# EAGLE design snowflake (EAGLE 9.6.2)
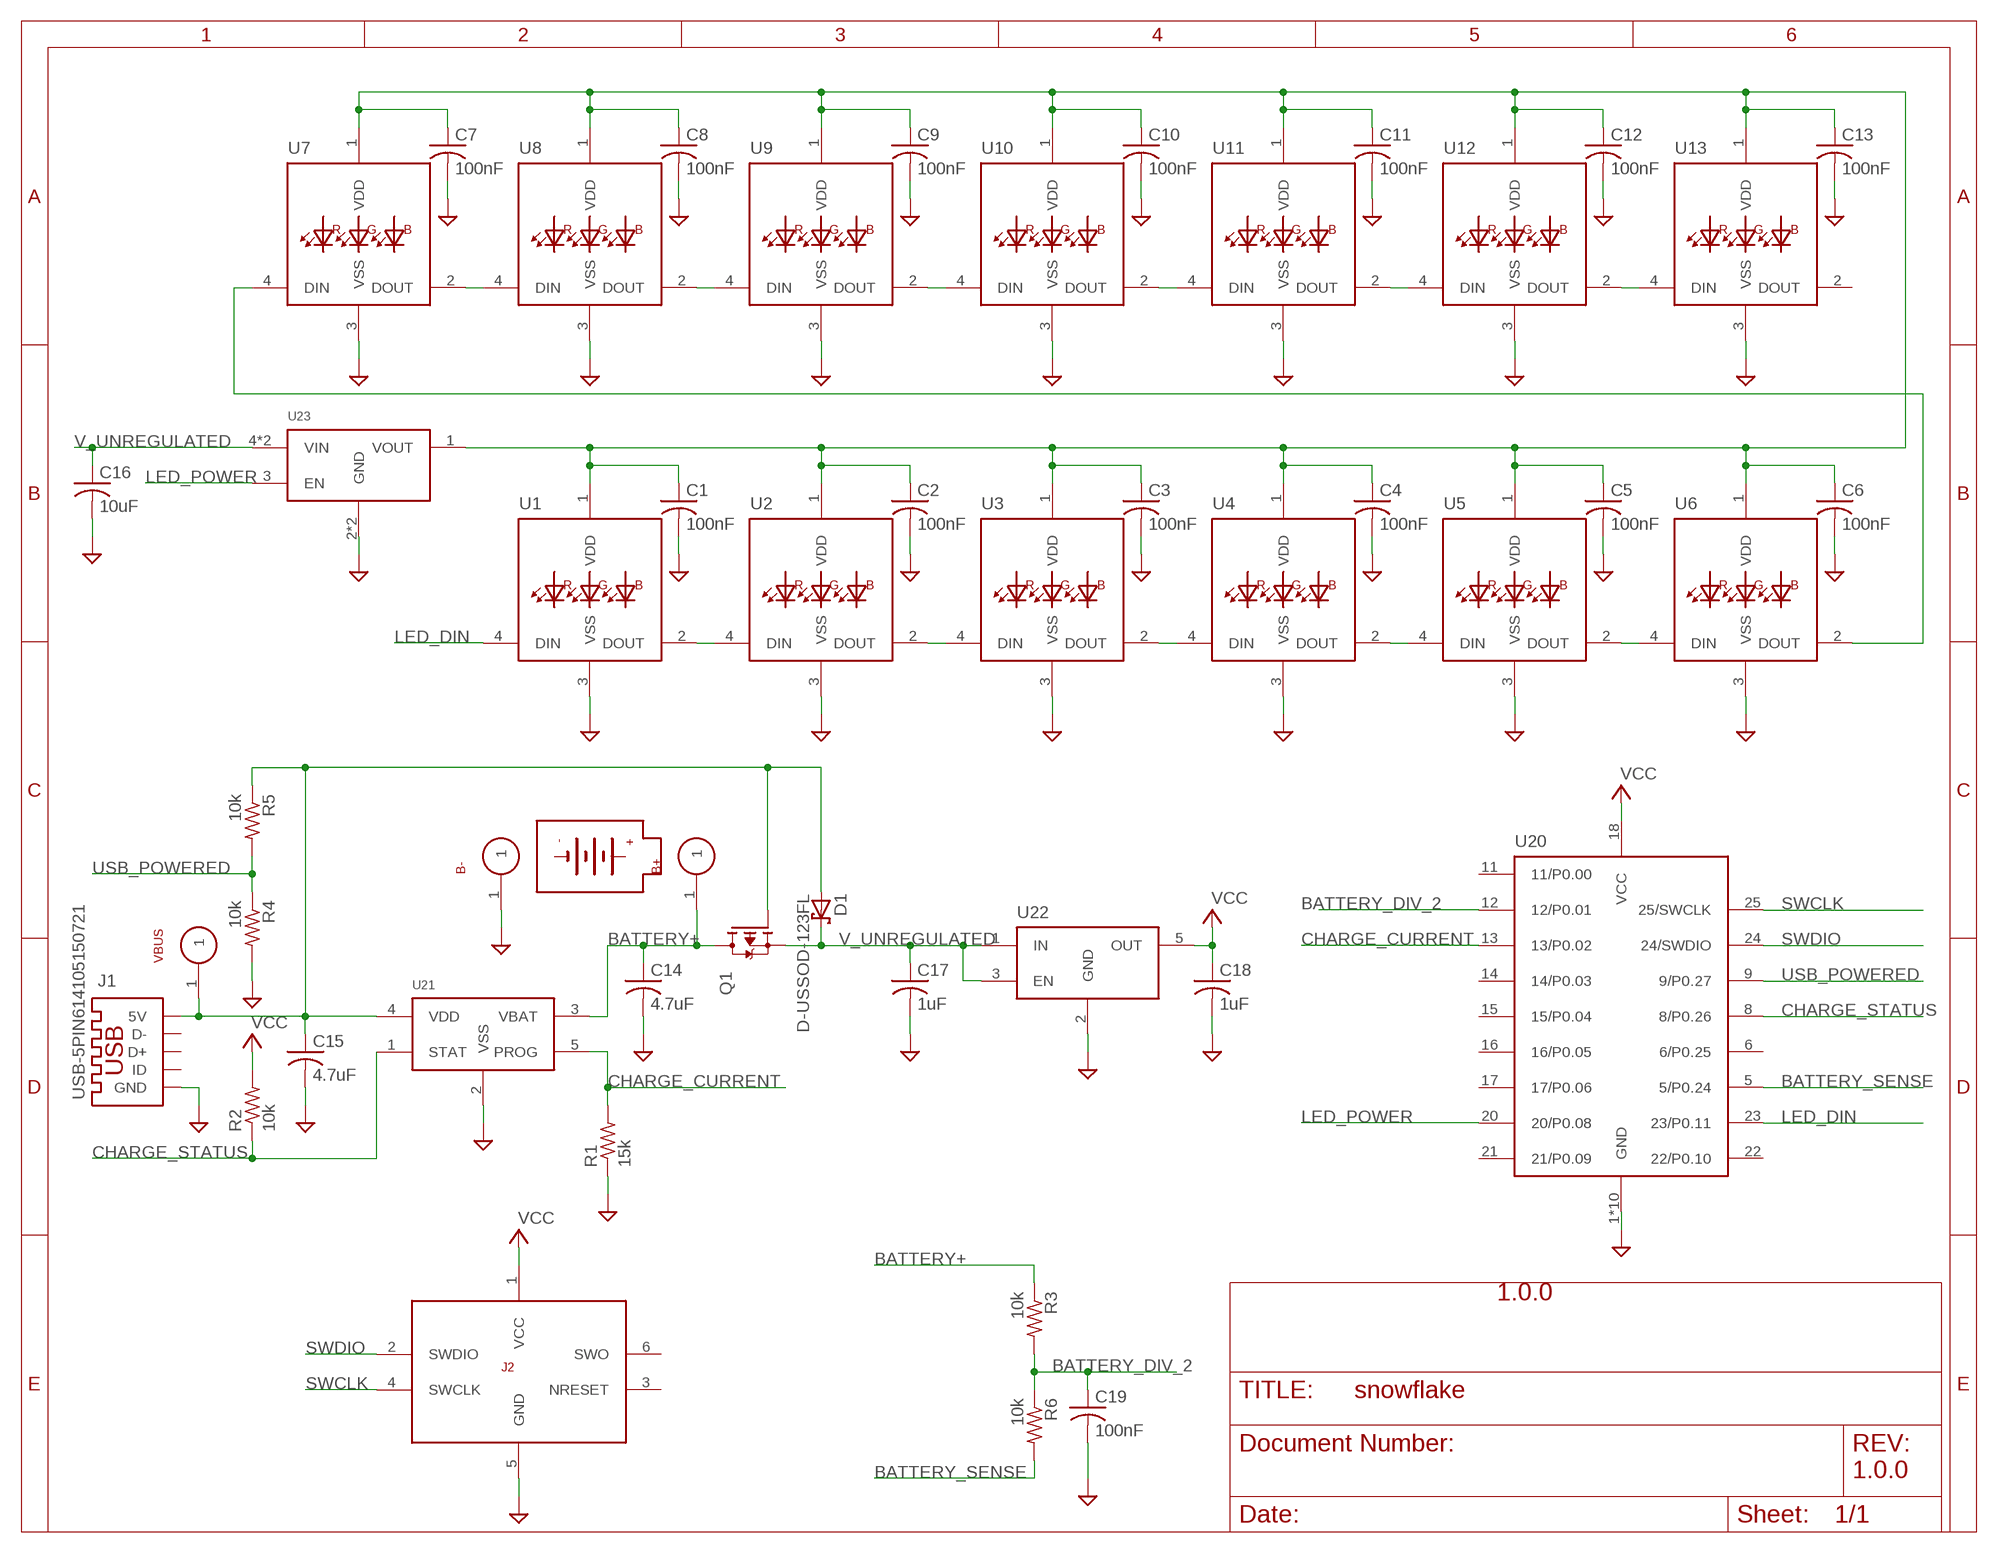
[diagram p0: schematic, sheet 1]
FRAME1 (FRAME_A_L): REV: 1.0.0

## Parts
B1  BATTERY_SHAPEDTP401525  [DTP401525]
B+  TARGET-PINWP-28AWG  [WP-28AWG]
B-  TARGET-PINWP-28AWG  [WP-28AWG]
C1  100nF  C-USC0805  [C0805]
C2  100nF  C-USC0805  [C0805]
C3  100nF  C-USC0805  [C0805]
C4  100nF  C-USC0805  [C0805]
C5  100nF  C-USC0805  [C0805]
C6  100nF  C-USC0805  [C0805]
C7  100nF  C-USC0805  [C0805]
C8  100nF  C-USC0805  [C0805]
C9  100nF  C-USC0805  [C0805]
C10  100nF  C-USC0805  [C0805]
C11  100nF  C-USC0805  [C0805]
C12  100nF  C-USC0805  [C0805]
C13  100nF  C-USC0805  [C0805]
C14  4.7uF  C-USC0805  [C0805]
C15  4.7uF  C-USC0805  [C0805]
C16  10uF  C-USC0805  [C0805]
C17  1uF  C-USC0805  [C0805]
C18  1uF  C-USC0805  [C0805]
C19  100nF  C-USC0805  [C0805]
D1  D-USSOD-123FL  [SOD-123FL]
J1  USB-5PIN614105150721  [614105150721]
J2  TC2030-SWD  [TC2030-MCP-NL]
Q1  FET-PSOT-23-3  [SOT-23-3]
R1  15k  R-USR0805  [R0805]
R2  10k  R-USR0805  [R0805]
R3  10k  R-USR0805  [R0805]
R4  10k  R-USR0805  [R0805]
R5  10k  R-USR0805  [R0805]
R6  10k  R-USR0805  [R0805]
U1  WS2812B  [WS2812B]
U2  WS2812B  [WS2812B]
U3  WS2812B  [WS2812B]
U4  WS2812B  [WS2812B]
U5  WS2812B  [WS2812B]
U6  WS2812B  [WS2812B]
U7  WS2812B  [WS2812B]
U8  WS2812B  [WS2812B]
U9  WS2812B  [WS2812B]
U10  WS2812B  [WS2812B]
U11  WS2812B  [WS2812B]
U12  WS2812B  [WS2812B]
U13  WS2812B  [WS2812B]
U20  BMD-200  [BMD-200]
U21  MCP73832SOT-23-5  [SOT-23-5]
U22  ADP160  [TSOT-5]
U23  TPS22929D  [SOT-23-6]
VBUS  TARGET-PIN  [TARGET-PIN-1MM]

## Nets
BATTERY+: B+.1 C14.1 Q1.3(D) R3.1 U21.3(VBAT)
BATTERY_DIV_2: C19.1 R3.2 R6.1 U20.12(12/P0.01)
BATTERY_SENSE: R6.2 U20.5(5/P0.24)
CHARGE_CURRENT: R1.2 U20.13(13/P0.02) U21.5(PROG)
CHARGE_STATUS: R2.1 U20.8(8/P0.26) U21.1(STAT)
GND: B-.1 C1.2 C2.2 C3.2 C4.2 C5.2 C6.2 C7.2 C8.2 C9.2 C10.2 C11.2 C12.2 C13.2 C14.2 C15.2 C16.2 C17.2 C18.2 C19.2 J1.5(GND) J2.5(GND) R1.1 R4.2 U1.3(VSS) U2.3(VSS) U3.3(VSS) U4.3(VSS) U5.3(VSS) U6.3(VSS) U7.3(VSS) U8.3(VSS) U9.3(VSS) U10.3(VSS) U11.3(VSS) U12.3(VSS) U13.3(VSS) U20.1(GND) U20.2(GND) U20.3(GND) U20.4(GND) U20.7(GND) U20.10(GND) U20.19(GND) U20.26(GND) U20.27(GND) U20.28(GND) U21.2(VSS) U22.2(GND) U23.2(GND) U23.5(GND)
LED_DIN: U1.4(DIN) U20.23(23/P0.11)
LED_POWER: U20.20(20/P0.08) U23.3(EN)
N$1: U8.2(DOUT) U9.4(DIN)
N$2: U10.2(DOUT) U11.4(DIN)
N$3: U12.2(DOUT) U13.4(DIN)
N$4: U1.2(DOUT) U2.4(DIN)
N$5: U3.2(DOUT) U4.4(DIN)
N$6: U5.2(DOUT) U6.4(DIN)
N$7: U7.2(DOUT) U8.4(DIN)
N$8: U9.2(DOUT) U10.4(DIN)
N$9: U11.2(DOUT) U12.4(DIN)
N$10: U6.2(DOUT) U7.4(DIN)
N$11: U2.2(DOUT) U3.4(DIN)
N$12: U4.2(DOUT) U5.4(DIN)
N$14: C15.1 D1.A J1.1(5V) Q1.1(G) R5.1 U21.4(VDD) VBUS.1
SWCLK: J2.4(SWCLK) U20.25(25/SWCLK)
SWDIO: J2.2(SWDIO) U20.24(24/SWDIO)
USB_POWERED: R4.1 R5.2 U20.9(9/P0.27)
V_UNREGULATED: C16.1 C17.1 D1.C Q1.2(S) U22.1(IN) U22.3(EN) U23.4(VIN) U23.6(VIN)
VCC: C18.1 J2.1(VCC) R2.2 U20.18(VCC) U22.5(OUT)
VCC1: C1.1 C2.1 C3.1 C4.1 C5.1 C6.1 C7.1 C8.1 C9.1 C10.1 C11.1 C12.1 C13.1 U1.1(VDD) U2.1(VDD) U3.1(VDD) U4.1(VDD) U5.1(VDD) U6.1(VDD) U7.1(VDD) U8.1(VDD) U9.1(VDD) U10.1(VDD) U11.1(VDD) U12.1(VDD) U13.1(VDD) U23.1(VOUT)
Unconnected: J1.2(D-) J1.3(D+) J1.4(ID) J2.3(NRESET) J2.6(SWO) U13.2(DOUT) U20.6(6/P0.25) U20.11(11/P0.00) U20.14(14/P0.03) U20.15(15/P0.04) U20.16(16/P0.05) U20.17(17/P0.06) U20.21(21/P0.09) U20.22(22/P0.10)

## Notes on the sheet
- 1.0.0
- 1.0.0

## Library data of the parts
B1 = firefly:BATTERY_SHAPE; DNS: true
B+ B- VBUS = firefly:TARGET-PIN
C1-C13 = firefly:C-US: CAPACITOR, American symbol; MANUFACTURER: Yageo; ORDERING-CODE: CC0805KRX7R9BB104
C14 C15 = firefly:C-US: CAPACITOR, American symbol; MANUFACTURER: Yaego; ORDERING-CODE: CC0805MKX5R8BB475
C16 = firefly:C-US: CAPACITOR, American symbol; MANUFACTURER: YAEGO; ORDERING-CODE: CC0805KKX5R6BB106
C17 = firefly:C-US: CAPACITOR, American symbol; MANUFACTURER: YAGEO; ORDERING-CODE: CC0805KKX7R7BB105
C18 = firefly:C-US: CAPACITOR, American symbol; MANUFACTURER: Yageo; ORDERING-CODE: CC0805KKX7R7BB105
C19 = firefly:C-US: CAPACITOR, American symbol; MANUFACTURER: Yaego; ORDERING-CODE: CC0805KRX7R9BB104
D1 = firefly:D-US; MANUFACTURER: ON Semiconductor; ORDERING-CODE: MBR120VLSFT1G
J1 = firefly:USB-5PIN; MANUFACTURER: Wurth Electronics Inc; ORDERING-CODE: 614105150721
J2 = firefly:TC2030-SWD: Cortex-M Serial Wire Debug Connector; DNS: true
Q1 = firefly:FET-P; MANUFACTURER: Toshiba Semiconductor and Storage; ORDERING-CODE: SSM3J328R,LF
R1 = firefly:R-US: RESISTOR, American symbol; MANUFACTURER: Yageo; ORDERING-CODE: RC0805FR-0715KL
R2-R6 = firefly:R-US: RESISTOR, American symbol; MANUFACTURER: Yageo; ORDERING-CODE: RC0805FR-0710KL
U1-U13 = firefly:WS2812B; MANUFACTURER: worldsemi; ORDERING-CODE: WS2812B
U20 = firefly:BMD-200; MANUFACTURER: Rigado LLC; ORDERING-CODE: BMD-200-A-R
U21 = firefly:MCP73832; MANUFACTURER: Microchip Technology; ORDERING-CODE: MCP73832T-2ACI/OT
U22 = firefly:ADP160; MANUFACTURER: Analog Devices Inc.; ORDERING-CODE: ADP162AUJZ-3.3-R7
U23 = firefly:TPS22929D; MANUFACTURER: Toshiba Semiconductor and Storage; ORDERING-CODE: TCK107AF,LF

## Board
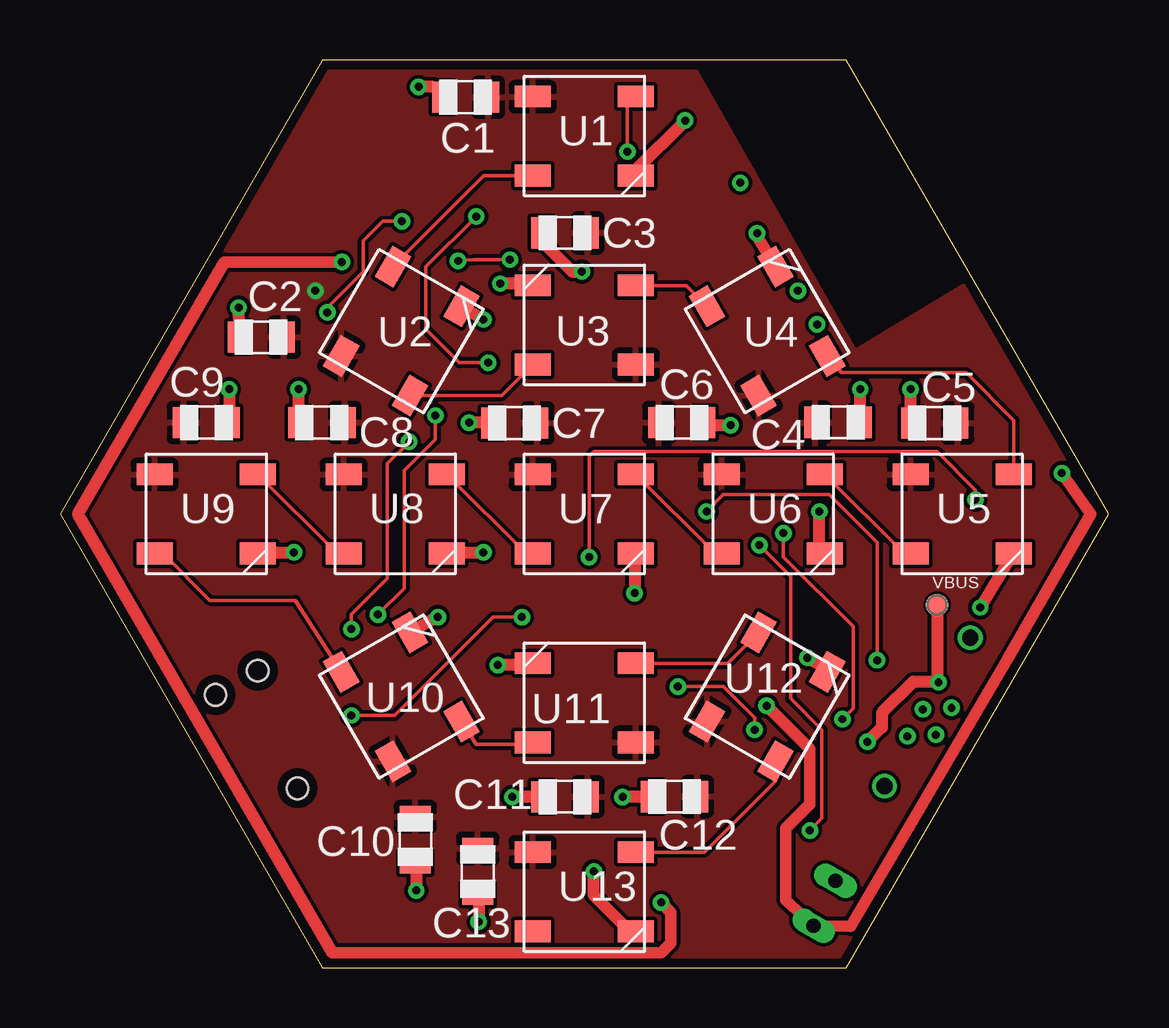
[diagram p1: board, top side]
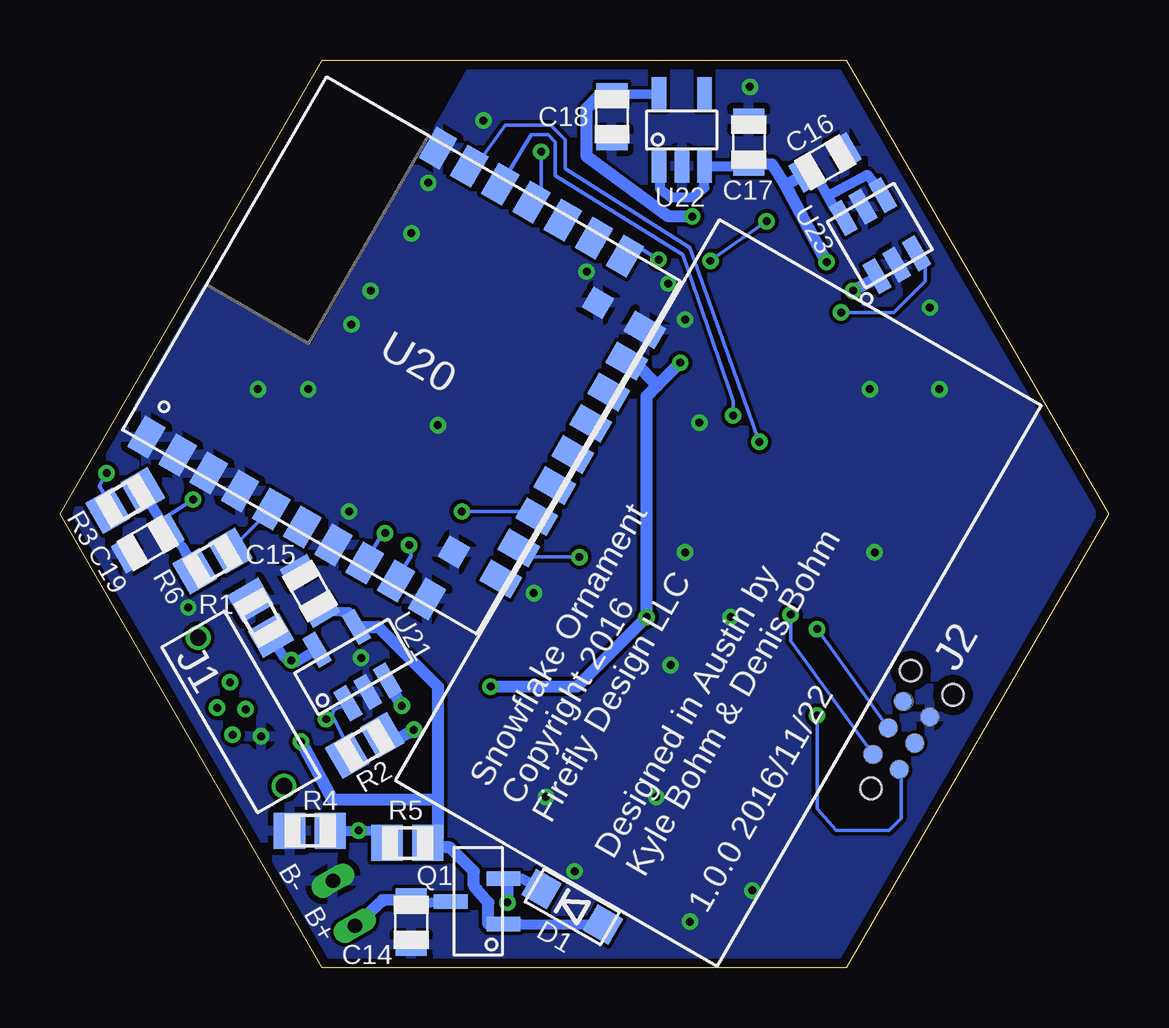
[diagram p2: board, bottom side, seen from below]

Size 43.69 x 37.85 mm. Coordinates in mm from the lower left corner, seen from the top.
Outline: 32.77,0 43.69,18.92 32.77,37.85 10.92,37.85 0,18.92 10.92,0 32.77,0
Copper layers (1*16): Top 0.0356mm / dielectric 1.5011mm / Bottom 0.0356mm
Design rules "oshpark-2layer": minimum track width 6mil, minimum drill 13mil, track to track 6mil, track to pad 6mil, pad to pad 6mil, via to via 6mil, smd to smd 6mil, copper to edge 15mil, drill to drill 6mil, minimum pad ring 7mil, minimum via ring 7mil, stop-mask expansion 2.5mil, vias tented up to drill 0mil, thermal gap 10mil

### Footprints (pad centres in the part's own frame; a part is rotated, then mirrored left to right if it is on the bottom)
WP-28AWG = drill 0.6 long: 1 0,0
C0805 = smd 0.9 x 1.3: 1 -0.95,0; 2 0.95,0
SOD-123FL = smd 1.22 x 1.25: A 1.475,0; C -1.475,0
614105150721 = drill 0.33: 1 -1.3,0.22; 2 -0.65,-0.78; 3 0,0.22; 4 0.65,-0.78; 5 1.3,0.22 | drill 0.675: G1 -3.575,0; G2 3.575,0
TC2030-MCP-NL = smd 0.787 x 0.787: 1 1.27,-0.635; 2 1.27,0.635; 3 2.54,-0.635; 4 2.54,0.635 | smd 0.72 x 0.72: 5 3.81,-0.635; 6 3.81,0.635 | hole 0.889: 0,0; 5.08,-1.016; 5.08,1.016
SOT-23-3 = smd 1.4 x 0.6: 1 -1.1,0.95; 2 -1.1,-0.95; 3 1.1,0
R0805 = smd 1.3 x 1.5: 1 -0.85,0; 2 0.85,0
WS2812B = smd 1.5 x 0.9: 1 -2.15,1.65; 2 -2.15,-1.65; 3 2.15,-1.65; 4 2.15,1.65
BMD-200 = smd 1 x 1.5: 1 -7.5,-8.25; 2 -6,-8.25; 3 -4.5,-8.25; 4 -3,-8.25; 5 -1.5,-8.25; 6 0,-8.25; 7 1.5,-8.25; 8 3,-8.25; 9 4.5,-8.25; 10 6,-8.25; 20 6,8.25; 21 4.5,8.25; 22 3,8.25; 23 1.5,8.25; 24 0,8.25; 25 -1.5,8.25; 26 -3,8.25 | smd 1.5 x 1: 11 8.25,-6; 12 8.25,-4.5; 13 8.25,-3; 14 8.25,-1.5; 15 8.25,0; 16 8.25,1.5; 17 8.25,3; 18 8.25,4.5; 19 8.25,6 | smd 1 x 1: 27 6,-6; 28 6,6
SOT-23-5 = smd 1.4 x 0.6: 1 -1.24,0.94; 2 -1.24,-0.01; 3 -1.24,-0.96; 4 1.34,-0.96; 5 1.34,0.94
TSOT-5 = smd 1.4 x 0.6: 1 -1.5,0.95; 2 -1.5,-0.01; 3 -1.5,-0.95; 4 1.5,-0.95; 5 1.5,0.95
SOT-23-6 = smd 1.4 x 0.6: 1 -1.4,0.95; 2 -1.4,0; 3 -1.4,-0.95; 4 1.4,-0.95; 5 1.4,0; 6 1.4,0.95
TARGET-PIN-1MM = smd 0.84 x 0.84: 1 0,0

### Placement (x,y rotation side)
B1  16.26,15.62 150 bottom
B+  31.4,1.75 120 bottom
B-  32.32,3.63 120 bottom
C1  16.9,36.3 180 top
C2  8.38,26.29 180 top
C3  21.04,30.64 180 top
C4  32.42,22.74 0 top
C5  36.45,22.71 180 top
C6  25.91,22.73 0 top
C7  18.94,22.71 180 top
C8  10.91,22.73 180 top
C9  6.1,22.73 0 top
C10  14.81,5.35 270 top
C11  21.04,7.13 180 top
C12  25.61,7.14 180 top
C13  17.41,4.02 270 top
C14  29.06,1.9 270 bottom
C15  33.27,15.71 120 bottom
C16  11.81,33.57 30 bottom
C17  14.99,34.42 90 bottom
C18  20.69,35.49 270 bottom
C19  40.03,17.71 210 bottom
D1  22.34,2.54 330 bottom
J1  36.14,10.67 300 bottom
J2  9.9,7.48 60 bottom
Q1  26.31,2.77 180 bottom
R1  35.32,14.59 300 bottom
R2  30.99,9.27 30 bottom
R3  40.97,19.47 30 bottom
R4  33.27,5.71 180 bottom
R5  29.21,5.21 180 bottom
R6  37.34,16.96 30 bottom
U1  21.84,34.67 0 top
U2  14.22,26.54 60 top
U3  21.84,26.8 180 top
U4  29.46,26.54 120 top
U5  37.59,18.92 0 top
U6  29.72,18.92 0 top
U7  21.84,18.92 0 top
U8  13.97,18.92 0 top
U9  6.1,18.92 0 top
U10  14.22,11.3 120 top
U11  21.84,11.05 180 top
U12  29.46,11.3 60 top
U13  21.84,3.17 0 top
U20  29.46,25.53 330 bottom
U21  31.5,12.57 120 bottom
U22  17.78,34.92 90 bottom
U23  9.53,30.52 120 bottom
VBUS  36.54,15.12 0 top

### Tracks (layer width: path | path; a pad name or v marks a point on that pad's centre or on a via)
BATTERY+  (via drill 0.33)
  Top 0.48: v41.74,20.62 42.94,18.92 39.44,12.82 32.94,1.72 B+.1 30.24,2.82 30.24,5.82 31.24,6.82 31.24,9.12 v29.44,10.92
  Bottom 0.152: R3.1 41.72,19.05 41.64,19.42 42.04,20.09 v41.74,20.62
  Bottom 0.406: Q1.3 28.77,2.67 C14.1
  Bottom 0.5: U21.3 v29.44,10.92 | C14.1 30.24,2.82 B+.1
BATTERY_DIV_2  (via drill 0.33)
  Top 0.152: v22.04,17.12 22.04,21.32 22.24,21.52 36.54,21.52 38.14,19.92 v38.14,19.52
  Bottom 0.152: U20.12 24.19,17.12 v22.04,17.12 | v38.14,19.52 39.24,18.82 39.3,18.2 C19.1
  Bottom 0.406: R6.1 38.6,17.57 C19.1 40.23,19.86 R3.2
BATTERY_SENSE
  Bottom 0.152: R6.2 36.52,17.5 U20.5
CHARGE_CURRENT  (via drill 0.33)
  Top 0.152: v26.94,19.02 27.64,19.72 32.04,19.72 34.04,17.72 v34.04,12.82
  Bottom 0.152: U20.13 24.04,19.02 v26.94,19.02 | v34.04,12.82 34.14,12.82
  Bottom 0.406: R1.2 34.9,13.81 34.34,12.92 34.14,12.82 33.92,12.72 U21.5
CHARGE_STATUS  (via drill 0.33)
  Top 0.152: v30.14,18.12 30.14,17.12 33.04,14.22 33.04,10.82 v32.6,10.37
  Bottom 0.152: R2.1 31.72,9.3 32.27,10.37 | 32.27,10.37 32.34,10.52 32.3,10.72 U21.1 | U20.8 30.24,18.13 v30.14,18.12 | v32.6,10.37 32.27,10.37
GND  (via drill 0.33)
  Top 0.5: U1.3 23.95,33.22 v26.04,35.32 | C1.2 15.84,36.52 15.54,36.72 v14.94,36.72 | C2.2 7.48,26.69 v7.44,27.52 | U2.3 17.48,27.12 v17.64,27.02 | U3.3 19.62,28.52 v18.34,28.52 | C3.2 20.08,30.62 20.04,30.32 21.34,29.02 v21.74,29.02 | C4.2 33.34,22.76 v33.34,24.12 | C5.2 35.44,22.77 v35.44,24.12 | C6.2 26.97,22.62 v27.94,22.62 | C7.2 v17.04,22.72 | v7.04,24.12 v7.05,24.12 C9.2 | C8.2 9.94,22.75 v9.94,24.12 | U9.3 8.3,17.32 v9.74,17.32 | U8.3 16.17,17.32 v17.64,17.32 | U7.3 23.94,17.22 v23.94,15.62 | U5.3 39.64,17.17 v38.34,15.02 | U6.3 31.64,17.5 v31.64,19.02 | U12.3 31.89,12.52 v31.14,12.92 | C12.2 24.64,7.12 v23.44,7.12 | C11.2 v18.84,7.12 | U11.3 19.62,12.62 v18.24,12.62 | U10.3 15.71,14.62 v15.74,14.62 | C10.2 14.84,4.36 v14.84,3.22 | C13.2 17.44,3.03 v17.44,1.92 | U13.3 24.1,1.42 23.84,1.42 22.24,3.02 v22.24,4.02 | U4.3 29.04,30.5 v29.04,30.62
  other vias: 28.34,32.72 31.54,26.82 30.74,28.22
  pour Bottom: 10.92,-0.13 32.77,-0.13 43.69,18.92 38.19,28.62 33.14,25.72 26.27,37.87 10.92,37.97 0,18.92
LED_DIN  (via drill 0.33)
  Top 0.152: v23.64,34.02 23.64,35.97 U1.4
  Bottom 0.152: U20.23 23.64,32.32 v23.64,34.02
LED_POWER  (via drill 0.33)
  Top 0.152: v11.14,27.32 11.14,27.52 12.64,29.02 12.64,30.32 13.44,31.12 v14.24,31.12 | v16.59,29.47 17.24,29.52 v18.74,29.52
  Bottom 0.152: U23.3 7.64,29.42 7.64,28.62 8.94,27.32 v11.14,27.32 | v14.24,31.12 v16.59,29.47 | U20.20 19.94,29.92 19.54,30.02 v18.74,29.52
N$1
  Top 0.152: U8.2 11.55,17.27 U9.4
N$2
  Top 0.152: U10.2 17.34,9.32 19.64,9.32 19.69,9.37 U11.4
N$3
  Top 0.152: U12.2 29.82,7.8 26.84,4.82 24.54,4.82 U13.4
N$4
  Top 0.152: U1.2 17.66,33.02 U2.4
N$5
  Top 0.152: U3.2 26.09,28.45 U4.4
N$6
  Top 0.152: U5.2 35.17,17.27 U6.4
N$7
  Top 0.152: U7.2 19.42,17.27 U8.4
N$8
  Top 0.152: U9.2 4.29,17.27 6.24,15.32 9.8,15.32 U10.4
N$9
  Top 0.152: U11.2 27.82,12.7 U12.4
N$10
  Top 0.152: U6.2 27.29,17.27 U7.4
N$11
  Top 0.152: U2.2 18.4,23.86 U3.4
N$12
  Top 0.152: U4.2 32.24,25.32 32.56,24.81 37.76,24.81 39.74,22.82 U5.4
N$14  (via drill 0.33)
  Top 0.152: J1.1 36.56,11.9 36.54,11.92
  Top 0.5: v33.64,9.42 34.24,10.02 34.24,10.62 35.54,11.92 36.54,11.92 VBUS.1
  Bottom 0.152: 28.18,5.02 R5.1
  Bottom 0.406: Q1.1 24.49,1.82 D1.A | C15.1 31.65,14.83 U21.4
  Bottom 0.5: Q1.1 25.84,1.82 25.84,2.71 25.84,2.72 26.44,3.42 26.44,4.02 27.44,5.02 28.18,5.02 | U21.4 30.43,14.21 27.94,11.72 27.94,7.02 | 27.94,7.02 27.94,5.42 R5.1 | v33.64,9.42 32.34,7.02 27.94,7.02
SWCLK  (via drill 0.33)
  Top 0.152: v14.54,21.92 13.64,21.02 13.64,16.22 12.14,14.72 v12.14,14.12
  Bottom 0.152: U20.25 26.64,33.63 26.54,33.72 26.14,33.72 25.14,35.12 23.24,35.12 22.64,34.52 22.64,33.32 17.44,30.02 v14.54,21.92 | v12.14,14.12 J2.4
SWDIO  (via drill 0.33)
  Top 0.152: v15.64,23.02 15.64,22.02 14.34,20.72 14.34,15.82 v13.24,14.72
  Bottom 0.152: U20.24 25.24,32.77 24.04,34.72 23.34,34.72 23.04,34.42 23.04,33.02 17.74,29.72 15.64,23.62 v15.64,23.02 | v13.24,14.72 13.24,13.62 J2.2
USB_POWERED  (via drill 0.33)
  Top 0.152: v29.14,17.62 30.44,16.32 30.44,11.22 31.74,9.92 31.74,6.22 v31.24,5.72
  Bottom 0.152: U20.9 29.04,17.18 v29.14,17.62 | v31.24,5.72 v31.24,5.71
  Bottom 0.406: R4.1 v31.24,5.71 31.23,5.71 30.44,5.72 30.44,5.59 R5.2
V_UNREGULATED  (via drill 0.33)
  Top 0.48: v25.04,2.72 25.44,2.32 25.44,1.02 25.04,0.62 11.34,0.62 0.74,18.92 6.84,29.42 v11.74,29.42
  Bottom 0.406: Q1.2 25.04,3.72 24.44,3.72 D1.C | U23.6 11.45,31.71 11.7,32.16 | 11.7,32.16 12.24,33.12 12.61,33.12 C16.1 | U23.4 10.04,33.06 11.7,32.16 | U22.1 18.7,32.48 18.24,32.12 17.34,32.12 16.84,32.52 U22.3 15.34,33.42 C17.1
  Bottom 0.5: C16.1 13.44,32.6 | 13.44,32.6 14.02,33.5 C17.1 | 25.04,3.72 v25.04,2.72 | v11.74,29.42 13.44,32.6
VCC  (via drill 0.33)
  Top 0.152: v28.94,9.92 28.94,10.42 27.64,11.72 v25.74,11.72 | v12.14,10.52 13.94,10.52 18.04,14.62 v19.24,14.62 | v17.84,25.22 16.64,25.22 15.24,26.62 15.24,29.22 v17.34,31.32
  Bottom 0.152: J2.1 8.64,8 8.64,6.22 9.14,5.72 11.34,5.72 12.14,6.62 v12.14,10.52 | U20.18 19.99,25.22
  Bottom 0.406: C18.1 U22.5
  Bottom 0.5: R2.2 30.08,9.52 29.64,9.52 v28.94,9.92 | v25.74,11.72 22.14,11.72 v19.24,14.62 19.24,23.82 18.79,24.27 | v17.34,31.32 18.34,31.32 21.74,33.82 21.74,35.82 21.19,36.38 C18.1 | 18.79,24.27 v17.84,25.22 | 19.99,25.22 19.74,25.22 18.79,24.27
VCC1  (via drill 0.33)
  Bottom 0.5: U23.1 9.65,28.73 v10.64,28.22
  pour Top: 0,18.92 10.92,37.85 26.27,37.85 33.14,25.72 37.94,28.62 43.69,18.92 32.77,0 10.92,0

### Text on the board
bPlace: Snowflake Ornament / Copyright 2016 / Firefly Design LLC / / Designed in Austin by / Kyle Bohm & Denis Bohm / / 1.0.0 2016/11/22